# EAGLE design platform (EAGLE 6.4)
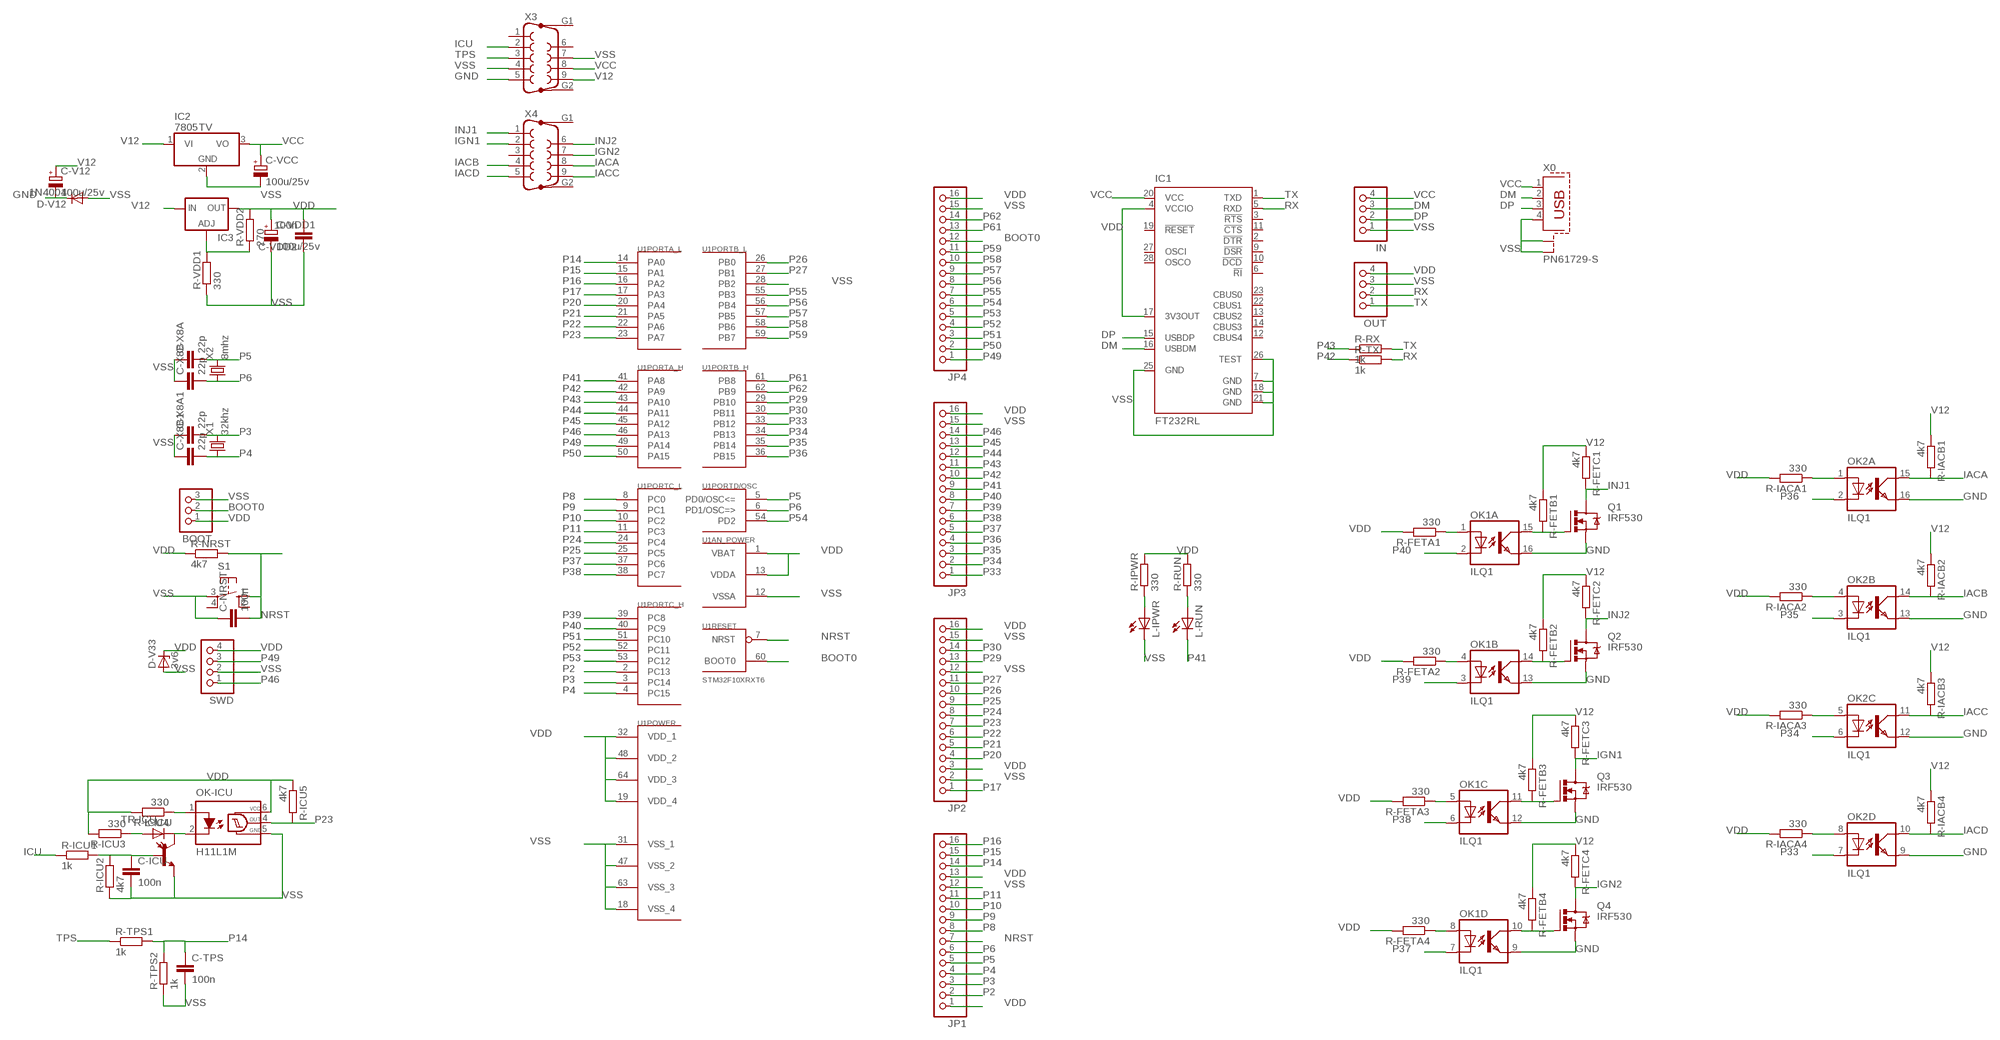
[diagram p0: schematic, sheet 1]

## Parts
BOOT  PINHD-1X3  [1X03]
C-ICU  100n  C-EU050-024X044  [C050-024X044]
C-NRST  100n  C-EU050-024X044  [C050-024X044]
C-TPS  100n  C-EU050-024X044  [C050-024X044]
C-V12  100u/25v  CPOL-EUE2-5  [E2-5]
C-VCC  100u/25v  CPOL-EUE2-5  [E2-5]
C-VDD1  100u/25v  CPOL-EUE2-5  [E2-5]
C-VDD2  100n  C-EU050-024X044  [C050-024X044]
C-X8A  22p  C-EU025-024X044  [C025-024X044]
C-X8A1  22p  C-EU025-024X044  [C025-024X044]
C-X8B  22p  C-EU025-024X044  [C025-024X044]
C-X8B1  22p  C-EU025-024X044  [C025-024X044]
D-V12  1N4004  [DO41-10]
D-V33  3v6  ZENER-DIODEZD-7.5  [ZDIO-7.5]
IC1  FT232RL  [SSOP28]
IC2  7805TV  [TO220V]
IC3  LM317TS  [317TS]
IN  PINHD-1X4  [1X04]
JP1  PINHD-1X16  [1X16]
JP2  PINHD-1X16  [1X16]
JP3  PINHD-1X16  [1X16]
JP4  PINHD-1X16  [1X16]
L-ICU  LED3MM  [LED3MM]
L-IPWR  LED3MM  [LED3MM]
L-RUN  LED3MM  [LED3MM]
OK1  ILQ1  [DIL16]
OK2  ILQ1  [DIL16]
OK-ICU  H11L1M  [DIL06]
OUT  PINHD-1X4  [1X04]
Q1  IRF530  [TO220BV]
Q2  IRF530  [TO220BV]
Q3  IRF530  [TO220BV]
Q4  IRF530  [TO220BV]
R-FETA1  330  R-EU_0204/7  [0204/7]
R-FETA2  330  R-EU_0204/7  [0204/7]
R-FETA3  330  R-EU_0204/7  [0204/7]
R-FETA4  330  R-EU_0204/7  [0204/7]
R-FETB1  4k7  R-EU_0204/7  [0204/7]
R-FETB2  4k7  R-EU_0204/7  [0204/7]
R-FETB3  4k7  R-EU_0204/7  [0204/7]
R-FETB4  4k7  R-EU_0204/7  [0204/7]
R-FETC1  4k7  R-EU_0204/7  [0204/7]
R-FETC2  4k7  R-EU_0204/7  [0204/7]
R-FETC3  4k7  R-EU_0204/7  [0204/7]
R-FETC4  4k7  R-EU_0204/7  [0204/7]
R-IACA1  330  R-EU_0204/7  [0204/7]
R-IACA2  330  R-EU_0204/7  [0204/7]
R-IACA3  330  R-EU_0204/7  [0204/7]
R-IACA4  330  R-EU_0204/7  [0204/7]
R-IACB1  4k7  R-EU_0204/7  [0204/7]
R-IACB2  4k7  R-EU_0204/7  [0204/7]
R-IACB3  4k7  R-EU_0204/7  [0204/7]
R-IACB4  4k7  R-EU_0204/7  [0204/7]
R-ICU1  1k  R-EU_0204/7  [0204/7]
R-ICU2  4k7  R-EU_0204/7  [0204/7]
R-ICU3  330  R-EU_0204/7  [0204/7]
R-ICU4  330  R-EU_0204/7  [0204/7]
R-ICU5  4k7  R-EU_0204/7  [0204/7]
R-IPWR  330  R-EU_0204/7  [0204/7]
R-NRST  4k7  R-EU_0204/7  [0204/7]
R-RUN  330  R-EU_0204/7  [0204/7]
R-RX  1k  R-EU_0204/7  [0204/7]
R-TPS1  1k  R-EU_0204/7  [0204/7]
R-TPS2  1k  R-EU_0204/7  [0204/7]
R-TX  1k  R-EU_0204/7  [0204/7]
R-VDD1  330  R-EU_0204/7  [0204/7]
R-VDD2  270  R-EU_0204/7  [0204/7]
S1  10-XX  [B3F-10XX]
SWD  PINHD-1X4  [1X04]
TR-ICU  2N3904-NPN-TO92-EBC  [TO92-EBC]
U1  STM32F10XRXT6  [TQFP64]
X0  PN61729-S  [PN61729-S]
X1  32khz  CRYSTALTC26V  [TC26V]
X2  8mhz  CRYSTALHC49U-V  [HC49U-V]
X3  F09HP  [F09HP]
X4  F09HP  [F09HP]

## Nets
BOOT0: BOOT.2 JP4.12 U1.60(RESET:BOOT0)
DM: IC1.16(USBDM) IN.3 X0.2
DP: IC1.15(USBDP) IN.2 X0.3
GND: C-V12.- D-V12.C OK1.9(D:EMIT) OK1.12(C:EMIT) OK1.13(B:EMIT) OK1.16(A:EMIT) OK2.9(D:EMIT) OK2.12(C:EMIT) OK2.13(B:EMIT) OK2.16(A:EMIT) Q1.S Q2.S Q3.S Q4.S X3.5
IACA: OK2.15(A:COL) R-IACB1.2 X4.8
IACB: OK2.14(B:COL) R-IACB2.2 X4.4
IACC: OK2.11(C:COL) R-IACB3.2 X4.9
IACD: OK2.10(D:COL) R-IACB4.2 X4.5
ICU: R-ICU1.1 X3.2
IGN1: Q3.D R-FETC3.2 X4.2
IGN2: Q4.D R-FETC4.2 X4.7
INJ1: Q1.D R-FETC1.2 X4.1
INJ2: Q2.D R-FETC2.2 X4.6
N$2: OK1.14(B:COL) Q2.G R-FETB2.2
N$3: C-ICU.1 R-ICU1.2 R-ICU2.2 TR-ICU.B
N$4: L-ICU.K(C) OK-ICU.2(C) TR-ICU.C
N$5: OK-ICU.1(A) R-ICU4.1
N$6: L-ICU.A R-ICU3.1
N$7: L-IPWR.A R-IPWR.1
N$8: L-RUN.A R-RUN.1
N$10: OK2.1(A:A) R-IACA1.1
N$11: OK1.15(A:COL) Q1.G R-FETB1.2
N$12: OK1.4(B:A) R-FETA2.1
N$13: OK1.1(A:A) R-FETA1.1
N$14: OK1.11(C:COL) Q3.G R-FETB3.2
N$15: OK1.5(C:A) R-FETA3.1
N$16: OK1.10(D:COL) Q4.G R-FETB4.2
N$17: OK1.8(D:A) R-FETA4.1
N$18: OK2.4(B:A) R-IACA2.1
N$21: OK2.5(C:A) R-IACA3.1
N$22: OK2.8(D:A) R-IACA4.1
N$25: IC3.1(ADJ) R-VDD1.2 R-VDD2.1
NRST: C-NRST.2 JP1.7 R-NRST.2 S1.1(S) U1.7(RESET:NRST)
P2: JP1.2 U1.2(PORTC_H:PC13)
P3: C-X8A1.2 JP1.3 U1.3(PORTC_H:PC14) X1.2
P4: C-X8B1.2 JP1.4 U1.4(PORTC_H:PC15) X1.1
P5: C-X8A.2 JP1.5 U1.5(PORTD/OSC:PD0/OSC<=) X2.2
P6: C-X8B.2 JP1.6 U1.6(PORTD/OSC:PD1/OSC=>) X2.1
P8: JP1.8 U1.8(PORTC_L:PC0)
P9: JP1.9 U1.9(PORTC_L:PC1)
P10: JP1.10 U1.10(PORTC_L:PC2)
P11: JP1.11 U1.11(PORTC_L:PC3)
P14: C-TPS.1 JP1.14 R-TPS1.2 R-TPS2.2 U1.14(PORTA_L:PA0)
P15: JP1.15 U1.15(PORTA_L:PA1)
P16: JP1.16 U1.16(PORTA_L:PA2)
P17: JP2.1 U1.17(PORTA_L:PA3)
P20: JP2.4 U1.20(PORTA_L:PA4)
P21: JP2.5 U1.21(PORTA_L:PA5)
P22: JP2.6 U1.22(PORTA_L:PA6)
P23: JP2.7 OK-ICU.4(OUT) R-ICU5.2 U1.23(PORTA_L:PA7)
P24: JP2.8 U1.24(PORTC_L:PC4)
P25: JP2.9 U1.25(PORTC_L:PC5)
P26: JP2.10 U1.26(PORTB_L:PB0)
P27: JP2.11 U1.27(PORTB_L:PB1)
P29: JP2.13 U1.29(PORTB_H:PB10)
P30: JP2.14 U1.30(PORTB_H:PB11)
P33: JP3.1 OK2.7(D:C) U1.33(PORTB_H:PB12)
P34: JP3.2 OK2.6(C:C) U1.34(PORTB_H:PB13)
P35: JP3.3 OK2.3(B:C) U1.35(PORTB_H:PB14)
P36: JP3.4 OK2.2(A:C) U1.36(PORTB_H:PB15)
P37: JP3.5 OK1.7(D:C) U1.37(PORTC_L:PC6)
P38: JP3.6 OK1.6(C:C) U1.38(PORTC_L:PC7)
P39: JP3.7 OK1.3(B:C) U1.39(PORTC_H:PC8)
P40: JP3.8 OK1.2(A:C) U1.40(PORTC_H:PC9)
P41: JP3.9 L-RUN.K(C) U1.41(PORTA_H:PA8)
P42: JP3.10 R-TX.1 U1.42(PORTA_H:PA9)
P43: JP3.11 R-RX.1 U1.43(PORTA_H:PA10)
P44: JP3.12 U1.44(PORTA_H:PA11)
P45: JP3.13 U1.45(PORTA_H:PA12)
P46: JP3.14 SWD.1 U1.46(PORTA_H:PA13)
P49: JP4.1 SWD.3 U1.49(PORTA_H:PA14)
P50: JP4.2 U1.50(PORTA_H:PA15)
P51: JP4.3 U1.51(PORTC_H:PC10)
P52: JP4.4 U1.52(PORTC_H:PC11)
P53: JP4.5 U1.53(PORTC_H:PC12)
P54: JP4.6 U1.54(PORTD/OSC:PD2)
P55: JP4.7 U1.55(PORTB_L:PB3)
P56: JP4.8 U1.56(PORTB_L:PB4)
P57: JP4.9 U1.57(PORTB_L:PB5)
P58: JP4.10 U1.58(PORTB_L:PB6)
P59: JP4.11 U1.59(PORTB_L:PB7)
P61: JP4.13 U1.61(PORTB_H:PB8)
P62: JP4.14 U1.62(PORTB_H:PB9)
RX: IC1.5(RXD) OUT.2 R-TX.2
TPS: R-TPS1.1 X3.3
TX: IC1.1(TXD) OUT.1 R-RX.2
V12: C-V12.+ IC2.1(VI) IC3.3(IN) R-FETB1.1 R-FETB2.1 R-FETB3.1 R-FETB4.1 R-FETC1.1 R-FETC2.1 R-FETC3.1 R-FETC4.1 R-IACB1.1 R-IACB2.1 R-IACB3.1 R-IACB4.1 X3.9
VCC: C-VCC.+ IC1.20(VCC) IC2.3(VO) IN.4 X0.1 X3.8
VDD: BOOT.1 C-VDD1.+ C-VDD2.2 D-V33.C IC1.4(VCCIO) IC1.17(3V3OUT) IC3.2(OUT) JP1.1 JP1.13 JP2.3 JP2.16 JP3.16 JP4.16 OK-ICU.6(VCC) OUT.4 R-FETA1.2 R-FETA2.2 R-FETA3.2 R-FETA4.2 R-IACA1.2 R-IACA2.2 R-IACA3.2 R-IACA4.2 R-ICU3.2 R-ICU4.2 R-ICU5.1 R-IPWR.2 R-NRST.1 R-RUN.2 R-VDD2.2 SWD.4 U1.1(AN_POWER:VBAT) U1.13(AN_POWER:VDDA) U1.19(POWER:VDD_4) U1.32(POWER:VDD_1) U1.48(POWER:VDD_2) U1.64(POWER:VDD_3)
VSS: BOOT.3 C-ICU.2 C-NRST.1 C-TPS.2 C-VCC.- C-VDD1.- C-VDD2.1 C-X8A1.1 C-X8A.1 C-X8B1.1 C-X8B.1 D-V12.A D-V33.A IC1.7(GND) IC1.18(GND) IC1.21(GND) IC1.25(GND) IC1.26(TEST) IC2.2(GND) IN.1 JP1.12 JP2.2 JP2.12 JP2.15 JP3.15 JP4.15 L-IPWR.K(C) OK-ICU.5(GND) OUT.3 R-ICU2.1 R-TPS2.1 R-VDD1.1 S1.3(P) SWD.2 TR-ICU.E U1.12(AN_POWER:VSSA) U1.18(POWER:VSS_4) U1.28(PORTB_L:PB2) U1.31(POWER:VSS_1) U1.47(POWER:VSS_2) U1.63(POWER:VSS_3) X0.4 X0.S1 X0.S2 X3.4 X3.7
Unconnected: IC1.2(!DTR) IC1.3(!RTS) IC1.6(!RI) IC1.9(!DSR) IC1.10(!DCD) IC1.11(!CTS) IC1.12(CBUS4) IC1.13(CBUS2) IC1.14(CBUS3) IC1.19(!RESET) IC1.22(CBUS1) IC1.23(CBUS0) IC1.27(OSCI) IC1.28(OSCO) S1.2(S1) S1.4(P1) X3.1 X3.6 X3.G1 X3.G2 X4.3 X4.G1 X4.G2

## Library data of the parts
BOOT = pinhead:PINHD-1X3: PIN HEADER
C-ICU C-NRST C-TPS C-VDD2 C-X8A C-X8A1 C-X8B C-X8B1 = resistor:C-EU: CAPACITOR, European symbol
C-V12 C-VCC C-VDD1 = resistor:CPOL-EU: POLARIZED CAPACITOR, European symbol
D-V12 = diode:1N4004: DIODE general purpose rectifier, 1 A
D-V33 = diode:ZENER-DIODE: Z-Diode
IC1 = ftdichip:FT232R: Source: http://www.ftdichip.com/Documents/DataSheets/DS_FT232R_v104.pdf; MPN: FT232RL; OC_FARNELL: 1146032; OC_NEWARK: 91K9918
IC2 = linear:78*: Positive VOLTAGE REGULATOR Source: http://cache.national.com/ds/LM/LM78L05.pdf http://www.fairchildsemi.com/ds/LM/LM7805.pdf
IC3 = v-reg:LM317TS: VOLTAGE REGULATOR
IN OUT SWD = pinhead:PINHD-1X4: PIN HEADER
JP1-JP4 = pinhead:PINHD-1X16: PIN HEADER
L-ICU L-IPWR L-RUN = led:LED: LED OSRAM: - CHIPLED LG R971, LG N971, LY N971, LG Q971, LY Q971, LO R971, LY R971 LH N974, LH R974 LS Q976, LO Q976, LY Q976 LO Q996 - Hyper CHIPLED LW Q18S LB Q993, LB Q99A, LB R99A - SideLED LS A670, LO A670, LY A670, LG A670, LP A670 LB A673, LV A673, LT A673, LW A673 LH A674 LY A675 LS A676, LA A676, LO A676, LY A676, LW A676 LS A679, LY A679, LG A679 - Hyper Micro SIDELED® LS Y876, LA Y876, LO Y876, LY Y876 LT Y87S - SmartLED LW L88C, LW L88S LB L89C, LB L89S, LG L890 LS L89K, LO L89K, LY L89K LS L896, LA L896, LO L896, LY L896 - TOPLED LS T670, LO T670, LY T670, LG T670, LP T670 LSG T670, LSP T670, LSY T670, LOP T670, LYG T670 LG T671, LOG T671, LSG T671 LB T673, LV T673, LT T673, LW T673 LH T674 LS T676, LA T676, LO T676, LY T676, LB T676, LH T676, LSB T676, LW T676 LB T67C, LV T67C, LT T67C, LS T67K, LO T67K, LY T67K, LW E67C LS E67B, LA E67B, LO E67B, LY E67B, LB E67C, LV E67C, LT E67C LW T67C LS T679, LY T679, LG T679 LS T770, LO T770, LY T770, LG T770, LP T770 LB T773, LV T773, LT T773, LW T773 LH T774 LS E675, LA E675, LY E675, LS T675 LS T776, LA T776, LO T776, LY T776, LB T776 LHGB T686 LT T68C, LB T68C - Hyper Mini TOPLED® LB M676 - Mini TOPLED Santana® LG M470 LS M47K, LO M47K, LY M47K Source: http://www.osram.convergy.de LUXEON: - LUMILED® LXK2-PW12-R00, LXK2-PW12-S00, LXK2-PW14-U00, LXK2-PW14-V00 LXK2-PM12-R00, LXK2-PM12-S00, LXK2-PM14-U00 LXK2-PE12-Q00, LXK2-PE12-R00, LXK2-PE12-S00, LXK2-PE14-T00, LXK2-PE14-U00 LXK2-PB12-K00, LXK2-PB12-L00, LXK2-PB12-M00, LXK2-PB14-N00, LXK2-PB14-P00, LXK2-PB14-Q00 LXK2-PR12-L00, LXK2-PR12-M00, LXK2-PR14-Q00, LXK2-PR14-R00 LXK2-PD12-Q00, LXK2-PD12-R00, LXK2-PD12-S00 LXK2-PH12-R00, LXK2-PH12-S00 LXK2-PL12-P00, LXK2-PL12-Q00, LXK2-PL12-R00 Source: www.luxeon.com KINGBRIGHT: KA-3528ASYC Source: www.kingbright.com
OK1 OK2 = optocoupler:ILQ1: SIEMENS OPTO COUPLER; MF: VISHAY/TELEFUNKEN; MPN: ILQ1; OC_FARNELL: 1469501; OC_NEWARK: 88K1954
OK-ICU = optocoupler:H11L*M: 6-Pin DIP Optocoupler Source: http://www.fairchildsemi.com/ds/H1/H11L2-M.pdf; MF: FAIRCHILD SEMICONDUCTOR; MPN: H11L1-M; OC_FARNELL: 1021127; OC_NEWARK: 72K8643
Q1-Q4 = transistor-power:IRF530: HEXFET Power MOSFET
R-FETA1-R-FETA4 R-FETB1-R-FETB4 R-FETC1-R-FETC4 R-IACA1-R-IACA4 R-IACB1-R-IACB4 R-ICU1-R-ICU5 R-IPWR R-NRST R-RUN R-RX R-TPS1 R-TPS2 R-TX R-VDD1 R-VDD2 = resistor:R-EU_: RESISTOR, European symbol
S1 = switch-omron:10-XX: OMRON SWITCH; MPN: B3F-1000; OC_FARNELL: 176432; OC_NEWARK: 36M3542
TR-ICU = transistor-neu-to92:*-NPN-: NPN Transistror
U1 = stm32:STM32F10XRXT6: STM32F101/103 64pin LQFP
X0 = con-berg:PN61729-S: BERG USB connector; OC_FARNELL: unknown; OC_NEWARK: unknown
X1 = crystal:CRYSTAL: CRYSTAL; OC_FARNELL: unknown; OC_NEWARK: unknown
X2 = crystal:CRYSTAL: CRYSTAL; OC_FARNELL: 1666969; OC_NEWARK: unknown
X3 X4 = con-subd:F09HP: SUB-D; OC_FARNELL: unknown; OC_NEWARK: unknown

## Board
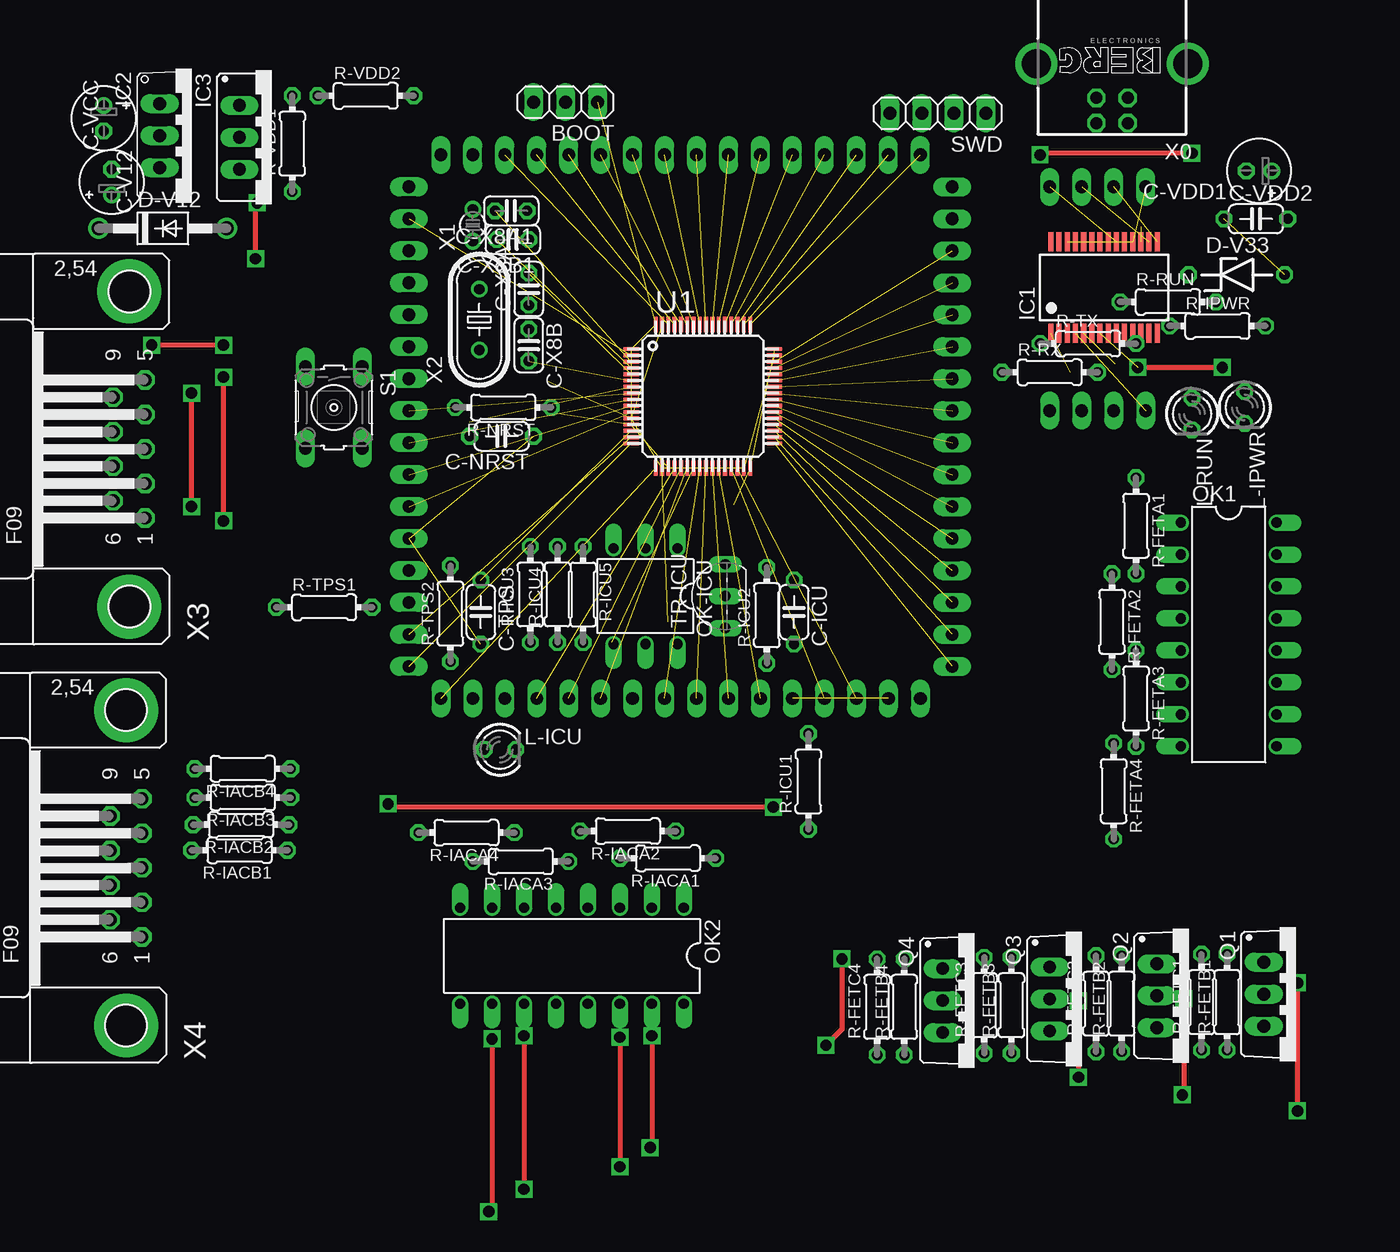
[diagram p1: board, top side]
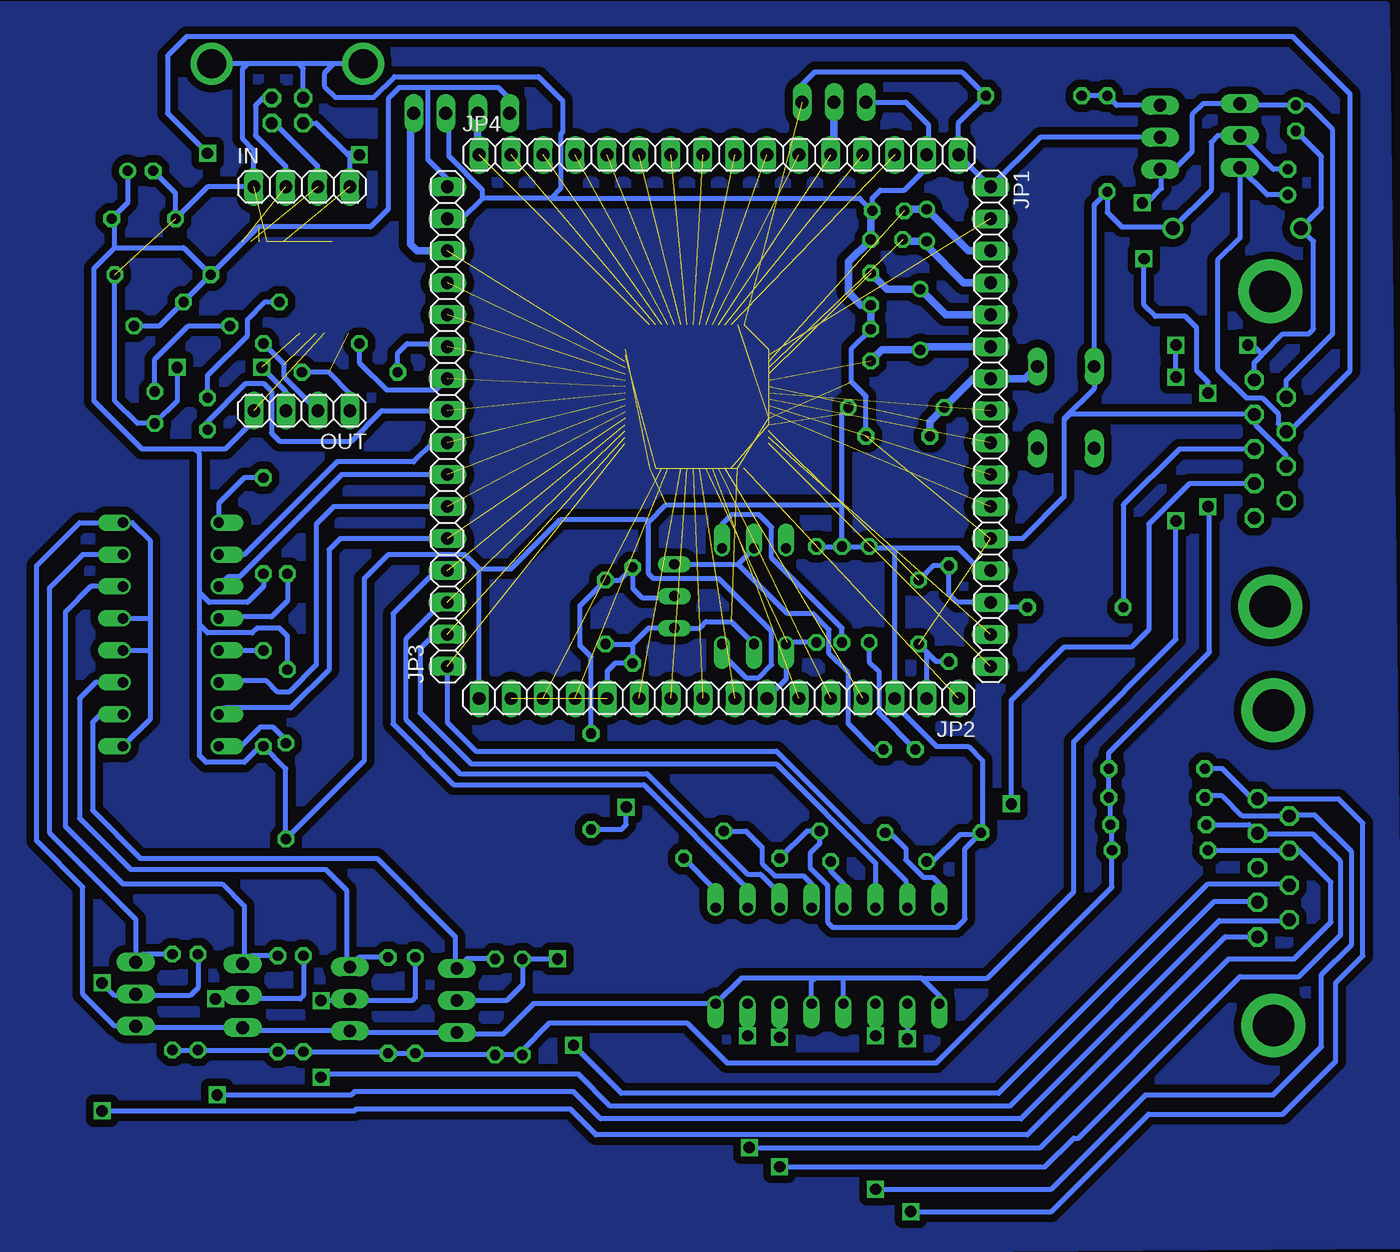
[diagram p2: board, bottom side, seen from below]

No outline drawn. Coordinates in mm, seen from the top.
Copper layers (1*16): Top 0.035mm / dielectric 1.5mm / Bottom 0.035mm
Design rules "default": minimum track width 10mil, minimum drill 24mil, track to track 8mil, track to pad 8mil, pad to pad 8mil, via to via 8mil, smd to smd 8mil, copper to edge 40mil, drill to drill 8mil, minimum pad ring 10mil, minimum via ring 8mil, stop-mask expansion 4mil, vias tented up to drill 0mil, thermal gap 10mil

### Footprints (pad centres in the part's own frame; a part is rotated, then mirrored left to right if it is on the bottom)
1X03 = drill 1.016 long: 1 -2.54,0; 2 0,0; 3 2.54,0
C050-024X044 = drill 0.813 octagon: 1 -2.54,0; 2 2.54,0
E2-5 = drill 0.813 pad 1.27: + -1.016,0 | drill 0.813 pad 1.27 octagon: - 1.016,0
C025-024X044 = drill 0.813 octagon: 1 -1.27,0; 2 1.27,0
DO41-10 = drill 1.118: A 5.08,0; C -5.08,0
ZDIO-7.5 = drill 0.813 octagon: A 3.81,0; C -3.81,0
SSOP28 = smd 0.4 x 1.5: 1 -4.225,-3.625; 2 -3.575,-3.625; 3 -2.925,-3.625; 4 -2.275,-3.625; 5 -1.625,-3.625; 6 -0.975,-3.625; 7 -0.325,-3.625; 8 0.325,-3.625; 9 0.975,-3.625; 10 1.625,-3.625; 11 2.275,-3.625; 12 2.925,-3.625; 13 3.575,-3.625; 14 4.225,-3.625; 15 4.225,3.625; 16 3.575,3.625; 17 2.925,3.625; 18 2.275,3.625; 19 1.625,3.625; 20 0.975,3.625; 21 0.325,3.625; 22 -0.325,3.625; 23 -0.975,3.625; 24 -1.625,3.625; 25 -2.275,3.625; 26 -2.925,3.625; 27 -3.575,3.625; 28 -4.225,3.625
TO220V = drill 1.016 long: 1 -2.54,-2.54; 2 0,-2.54; 3 2.54,-2.54
317TS = drill 1.016 long: 1 -2.54,-2.54; 2 0,-2.54; 3 2.54,-2.54
1X04 = drill 1.016 long: 1 -3.81,0; 2 -1.27,0; 3 1.27,0; 4 3.81,0
1X16 = drill 1.016 long: 1 -19.05,0; 2 -16.51,0; 3 -13.97,0; 4 -11.43,0; 5 -8.89,0; 6 -6.35,0; 7 -3.81,0; 8 -1.27,0; 9 1.27,0; 10 3.81,0; 11 6.35,0; 12 8.89,0; 13 11.43,0; 14 13.97,0; 15 16.51,0; 16 19.05,0
LED3MM = drill 0.813 octagon: A -1.27,0; K 1.27,0
DIL16 = drill 0.813 offset: 1 -8.89,-3.81; 2 -6.35,-3.81; 3 -3.81,-3.81; 4 -1.27,-3.81; 5 1.27,-3.81; 6 3.81,-3.81; 7 6.35,-3.81; 8 8.89,-3.81; 9 8.89,3.81; 10 6.35,3.81; 11 3.81,3.81; 12 1.27,3.81; 13 -1.27,3.81; 14 -3.81,3.81; 15 -6.35,3.81; 16 -8.89,3.81
DIL06 = drill 0.813 offset: 1 -2.54,-3.81; 2 0,-3.81; 3 2.54,-3.81; 4 2.54,3.81; 5 0,3.81; 6 -2.54,3.81
TO220BV = drill 1.016 long: D 0,-2.54; G -2.54,-2.54; S 2.54,-2.54
0204/7 = drill 0.813 octagon: 1 -3.81,0; 2 3.81,0
B3F-10XX = drill 1.016 long: 1 -3.251,2.261; 2 3.251,2.261; 3 -3.251,-2.261; 4 3.251,-2.261
TO92-EBC = drill 0.813 long: B 0,-1.27; C 2.54,-1.27; E -2.54,-1.27
TQFP64 = smd 1.2 x 0.3: 1 -5.7,3.75; 2 -5.7,3.25; 3 -5.7,2.75; 4 -5.7,2.25; 5 -5.7,1.75; 6 -5.7,1.25; 7 -5.7,0.75; 8 -5.7,0.25; 9 -5.7,-0.25; 10 -5.7,-0.75; 11 -5.7,-1.25; 12 -5.7,-1.75; 13 -5.7,-2.25; 14 -5.7,-2.75; 15 -5.7,-3.25; 16 -5.7,-3.75; 33 5.7,-3.75; 34 5.7,-3.25; 35 5.7,-2.75; 36 5.7,-2.25; 37 5.7,-1.75; 38 5.7,-1.25; 39 5.7,-0.75; 40 5.7,-0.25; 41 5.7,0.25; 42 5.7,0.75; 43 5.7,1.25; 44 5.7,1.75; 45 5.7,2.25; 46 5.7,2.75; 47 5.7,3.25; 48 5.7,3.75 | smd 0.3 x 1.2: 17 -3.75,-5.7; 18 -3.25,-5.7; 19 -2.75,-5.7; 20 -2.25,-5.7; 21 -1.75,-5.7; 22 -1.25,-5.7; 23 -0.75,-5.7; 24 -0.25,-5.7; 25 0.25,-5.7; 26 0.75,-5.7; 27 1.25,-5.7; 28 1.75,-5.7; 29 2.25,-5.7; 30 2.75,-5.7; 31 3.25,-5.7; 32 3.75,-5.7; 49 3.75,5.7; 50 3.25,5.7; 51 2.75,5.7; 52 2.25,5.7; 53 1.75,5.7; 54 1.25,5.7; 55 0.75,5.7; 56 0.25,5.7; 57 -0.25,5.7; 58 -0.75,5.7; 59 -1.25,5.7; 60 -1.75,5.7; 61 -2.25,5.7; 62 -2.75,5.7; 63 -3.25,5.7; 64 -3.75,5.7
PN61729-S = drill 0.95 octagon: 1 1.25,4.71; 2 -1.25,4.71; 3 -1.25,2.71; 4 1.25,2.71 | drill 2.3 pad 2.9: S1 -6.02,0; S2 6.02,0
TC26V = drill 0.813: 1 -1.27,0; 2 1.27,0
HC49U-V = drill 0.813: 1 -2.413,0; 2 2.413,0
F09HP = drill 1.016 octagon: 1 -5.486,-1.27; 2 -2.743,-1.27; 3 0,-1.27; 4 2.743,-1.27; 5 5.486,-1.27; 6 -4.115,1.27; 7 -1.372,1.27; 8 1.372,1.27; 9 4.115,1.27 | drill 3.302 pad 5.08: G1 -12.522,0; G2 12.522,0

### Placement (x,y rotation side)
BOOT  37.85,76.58 180 top
C-ICU  56.01,36.07 270 top
C-NRST  32.77,50.04 180 top
C-TPS  31.11,36.07 270 top
C-V12  1.14,75.31 270 top
C-VCC  1.78,70.23 90 top
C-VDD1  92.96,71.12 180 top
C-VDD2  92.71,67.31 0 top
C-X8A  34.92,61.72 90 top
C-X8A1  33.53,67.94 180 top
C-X8B  34.92,57.28 270 top
C-X8B1  33.66,65.66 180 top
D-V12  5.84,66.55 0 top
D-V33  91.19,62.87 0 top
IC1  80.64,61.85 0 top
IC2  8.13,73.91 270 top
IC3  14.48,73.79 270 top
IN  80.14,69.85 0 bottom
JP1  25.4,50.8 270 bottom
JP2  46.99,29.21 180 bottom
JP3  68.58,50.8 90 bottom
JP4  46.99,72.39 0 bottom
L-ICU  32.64,25.15 0 top
L-IPWR  91.82,52.32 270 top
L-RUN  87.63,51.82 270 top
OK1  90.55,34.29 270 top
OK2  38.35,8.76 180 top
OK-ICU  44.2,37.34 180 top
OUT  80.14,52.07 180 bottom
Q1  95.89,5.71 270 top
Q2  87.38,5.59 270 top
Q3  78.87,5.33 270 top
Q4  70.36,5.21 270 top
R-FETA1  83.19,42.93 270 top
R-FETA2  81.28,35.31 270 top
R-FETA3  83.19,29.21 270 top
R-FETA4  81.41,21.84 270 top
R-FETB1  90.42,5.08 90 top
R-FETB2  82.04,4.95 90 top
R-FETB3  73.28,4.83 90 top
R-FETB4  64.77,4.7 90 top
R-FETC1  88.39,5.08 90 top
R-FETC2  80.01,4.95 90 top
R-FETC3  71.12,4.83 90 top
R-FETC4  62.61,4.7 90 top
R-IACA1  45.97,16.51 180 top
R-IACA2  42.8,18.67 180 top
R-IACA3  34.29,16.26 180 top
R-IACA4  29.97,18.54 180 top
R-IACB1  11.94,17.14 180 top
R-IACB2  12.06,19.18 180 top
R-IACB3  12.19,21.34 180 top
R-IACB4  12.19,23.62 180 top
R-ICU1  57.15,22.61 90 top
R-ICU2  53.85,35.81 90 top
R-ICU3  35.05,37.47 90 top
R-ICU4  37.21,37.47 90 top
R-ICU5  39.24,37.47 270 top
R-IPWR  89.66,58.8 0 top
R-NRST  32.89,52.32 180 top
R-RUN  85.72,60.71 0 top
R-RX  76.33,55.12 0 top
R-TPS1  18.67,36.45 0 top
R-TPS2  28.7,35.94 90 top
R-TX  79.38,57.4 0 top
R-VDD1  16.13,73.28 90 top
R-VDD2  21.97,77.09 0 top
S1  19.43,52.32 270 top
SWD  67.44,75.69 180 top
TR-ICU  49.28,37.34 90 top
U1  48.77,53.21 0 top
X0  81.28,79.63 180 top
X1  30.48,66.8 90 top
X2  30.99,59.31 90 top
X3  3.17,49.02 90 top
X4  2.92,15.75 90 top

### Tracks (layer width: path | path; a pad name or v marks a point on that pad's centre or on a via)
BOOT0  (1 unrouted)
  Bottom 0.61: BOOT.2 37.85,72.64 JP4.12
DM  (1 unrouted)
  Bottom 0.406: X0.2 82.28,74.92 78.87,71.5 IN.3
DP  (1 unrouted)
  Bottom 0.406: X0.3 83.23,76.92 83.82,76.33 83.82,73.91 81.41,71.5 IN.2
GND  (via drill 0.9)
  Top 0.406: v10.67,43.31 v10.67,54.74 | v10.67,57.28 v4.95,57.28
  Bottom 0.406: 92.2,35.56 92.2,41.78 93.6,43.18 OK1.16 97.79,43.18 101.22,39.75 101.22,17.91 97.54,14.22 97.54,5.71 95,3.17 Q1.S 93.22,3.05 Q2.S 84.58,2.79 Q3.S 76.2,2.67 Q4.S 67.69,2.54 64.14,2.54 61.72,4.95 OK2.16 45.21,6.99 39.37,6.99 | 92.2,35.56 92.2,32.89 | 92.2,32.89 92.2,27.56 OK1.9 | OK1.12 92.33,33.02 92.2,32.89 | OK1.13 92.2,35.56 | C-V12.- -0.89,72.26 -0.89,68.2 D-V12.C -0.25,65.53 -0.25,58.55 0.13,58.17 2.16,58.17 3.81,56.52 | X3.5 4.45,55.88 3.81,56.52 | OK2.9 29.46,5.59 30.86,6.99 | 30.86,6.99 37.08,6.99 | 37.08,6.99 39.37,6.99 | OK2.13 39.62,6.73 39.37,6.99 | OK2.12 37.08,6.99 | 30.86,6.99 25.65,6.99 18.8,13.84 18.8,25.78 10.67,33.91 v10.67,43.31 | v10.67,54.74 v10.67,57.28 | v4.95,57.28 4.57,57.28 3.81,56.52
IACA  (via drill 0.9)
  Top 0.406: v44.7,2.41 44.7,-6.35 v44.58,-6.48
  Bottom 0.406: R-IACB1.2 8.1,17.12 X4.8 1.63,17.14 0.89,17.14 -1.65,14.61 -1.65,11.43 1.27,8.51 6.48,8.51 21.46,-6.48 v44.58,-6.48 | OK2.15 v44.7,2.41
IACB  (via drill 0.9)
  Top 0.406: v42.16,2.29 v42.16,-8
  Bottom 0.406: OK2.14 v42.16,2.29 | v42.16,-8 21.08,-8 18.8,-5.71 18.41,-5.71 5.59,7.11 0.89,7.11 -2.41,10.41 -2.41,16.26 -0.25,18.41 4.12,18.41 X4.4 4.88,19.18 R-IACB2.2
IACC  (via drill 0.9)
  Top 0.406: v34.54,2.41 v34.54,-9.78
  Bottom 0.406: OK2.11 v34.54,2.41 | v34.54,-9.78 20.57,-9.78 13.08,-2.29 2.92,-2.29 -0.89,1.52 -0.89,7.24 -3.3,9.65 -3.3,17.02 -0.38,19.94 1.57,19.94 X4.9 5.38,19.86 6.99,21.46 8.26,21.46 R-IACB3.2
IACD  (via drill 0.9)
  Top 0.406: v32,2.16 32,-11.3 v31.75,-11.56
  Bottom 0.406: R-IACB4.2 6.99,23.62 4.6,21.23 X4.5 4.17,21.21 -2.29,21.21 -4.19,19.3 -4.19,8.76 -2.03,6.6 -2.03,0.38 2.16,-3.81 12.83,-3.81 20.57,-11.56 v31.75,-11.56 | OK2.10 v32,2.16
ICU  (via drill 0.9)
  Top 0.406: v54.36,20.57 24,20.57 v23.75,20.83
  Bottom 0.406: X3.2 9.6,46.28 12.83,43.05 12.83,34.67 14.22,33.27 19.56,33.27 23.75,29.08 v23.75,20.83 | R-ICU1.1 54.74,18.8 54.36,19.18 v54.36,20.57
IGN1  (via drill 0.9)
  Top 0.406: v78.61,5.21 v78.61,-0.89
  Bottom 0.406: 76.2,5.21 71.37,5.21 71.12,5.46 R-FETC3.2 | 76.2,5.21 Q3.D | 76.2,5.21 v78.61,5.21 | X4.2 4.27,13.08 7.62,13.08 23.88,-3.17 55.63,-3.17 58.17,-0.64 78.36,-0.64 v78.61,-0.89
IGN2  (via drill 0.9)
  Top 0.406: v59.82,8.51 59.82,2.92 v58.55,1.65
  Bottom 0.406: Q4.D 63.88,5.21 62.61,6.48 R-FETC4.2 v59.82,8.51 | X4.7 1.75,14.48 8.13,14.48 24.77,-2.16 54.74,-2.16 v58.55,1.65
INJ1  (via drill 0.9)
  Top 0.406: v96.01,6.6 v96.01,-3.56
  Bottom 0.406: 93.22,5.59 89.03,5.59 88.39,6.22 R-FETC1.2 | 93.22,5.59 Q1.D | 93.22,5.59 95,5.59 v96.01,6.6 | v96.01,-3.56 75.95,-3.56 75.82,-3.43 58.8,-3.43 56.77,-5.46 22.48,-5.46 6.73,10.29 4.22,10.29 X4.1
INJ2  (via drill 0.9)
  Top 0.406: v87,5.33 87,-2.16 v86.87,-2.29
  Bottom 0.406: 84.58,5.33 80.26,5.33 80.01,5.59 R-FETC2.2 | 84.58,5.33 Q2.D | 84.58,5.33 v87,5.33 | v86.87,-2.29 76.2,-2.29 75.95,-2.03 58.55,-2.03 56.39,-4.19 22.99,-4.19 7.24,11.56 1.73,11.56 X4.6
N$1
  pour Bottom (isolate 0.61): -5.97,84.2 105.16,84.2 105.54,-14.99 -7.11,-14.1
N$2
  Bottom 0.406: OK1.14 96.9,38.1 98.93,36.07 98.93,19.05 94.36,14.48 86.49,14.48 84.71,12.7 84.71,8.26 Q2.G 84.2,8.76 R-FETB2.2
N$3
  Bottom 0.406: TR-ICU.B 50.67,37.21 53.09,37.21 53.85,37.97 R-ICU2.2 54.86,38.61 C-ICU.1 58.04,36.58 58.04,33.4 57.15,32.51 R-ICU1.2
N$4
  Bottom 0.406: TR-ICU.C 45.47,39.88 | 45.47,39.88 OK-ICU.2 | L-ICU.K 34.67,25.15 36.7,27.18 36.7,31.24 38.23,32.77 38.23,34.67 39.5,35.94 41.53,35.94 45.47,39.88
N$5
  Bottom 0.406: R-ICU4.1 37.21,34.8 42.8,40.39 42.8,42.8 43.81,43.81 45.97,43.81 46.74,43.05 OK-ICU.1
N$6
  Bottom 0.406: R-ICU3.1 35.05,32.13 34.29,31.37 34.29,28.07 L-ICU.A
N$7
  Bottom 0.406: L-IPWR.A 91.82,56.13 89.15,58.8 R-IPWR.1
N$8
  Bottom 0.406: L-RUN.A 87.63,54.86 84.45,58.04 84.45,59.31 83.06,60.71 R-RUN.1
N$10
  Bottom 0.406: OK2.1 47.24,13.97 R-IACA1.1
N$11
  Bottom 0.406: OK1.15 97.54,40.64 100.2,37.97 100.2,18.54 93.34,11.68 Q1.G 92.71,8.89 R-FETB1.2
N$12
  Bottom 0.406: R-FETA2.1 81.28,36.96 82.55,35.69 86.61,35.69 OK1.4
N$13
  Bottom 0.406: R-FETA1.1 84.71,46.74 86.74,44.7 OK1.1
N$14
  Bottom 0.406: OK1.11 96.52,30.48 97.79,29.21 97.79,19.68 93.73,15.62 78.23,15.62 76.58,13.97 76.58,8.13 Q3.G 75.56,8.64 R-FETB3.2
N$15
  Bottom 0.406: OK1.5 R-FETA3.1
N$16
  Bottom 0.406: OK1.10 96.14,27.94 96.77,27.3 96.77,20.32 92.96,16.51 74.17,16.51 67.94,10.29 67.94,7.87 Q4.G 67.06,8.51 R-FETB4.2
N$17
  Bottom 0.406: R-FETA4.1 81.41,25.91 82.42,26.92 83.44,26.92 84.96,25.4 OK1.8
N$18
  Bottom 0.406: R-IACA2.1 44.83,18.67 43.56,17.4 43.56,16.13 42.55,15.11 40.26,15.11 39.62,14.48 OK2.4
N$21
  Bottom 0.406: R-IACA3.1 38.1,15.49 37.08,14.48 OK2.5
N$22
  Bottom 0.406: R-IACA4.1 33.4,18.54 32.13,17.27 32.13,16.38 30.73,14.99 29.97,14.99 29.46,14.48 OK2.8
N$25
  Bottom 0.406: IC3.1 15.37,76.33 R-VDD1.2 R-VDD2.1
N$32  (via drill 0.9)
  other vias: 75.56,72.39
NRST  (1 unrouted)
  Bottom 0.61: C-NRST.2 30.23,51.18 R-NRST.2 26.8,54.61 JP1.7 22.66,54.61 S1.1
P2  (1 unrouted)
P3  (1 unrouted)
  Bottom 0.61: JP1.3 27.18,64.77 X1.2 32.13,68.07 C-X8A1.2
P4  (1 unrouted)
  Bottom 0.61: C-X8B1.2 32.26,65.53 X1.1 30.48,65.15 27.56,62.23 JP1.4
P5  (1 unrouted)
  Bottom 0.61: JP1.5 28.96,59.69 X2.2 33.66,61.72 C-X8A.2
P6  (1 unrouted)
  Bottom 0.61: JP1.6 30.73,57.15 X2.1 34.04,56.9 C-X8B.2
P8  (1 unrouted)
P9  (1 unrouted)
P10  (1 unrouted)
P11  (1 unrouted)
P14  (1 unrouted)
  Bottom 0.406: R-TPS1.2 25.02,36.45 JP1.14 28.07,36.83 28.7,37.47 R-TPS2.2 29.97,39.75 C-TPS.1
P15  (1 unrouted)
P16  (1 unrouted)
P17  (1 unrouted)
P20  (1 unrouted)
P21  (1 unrouted)
P22  (1 unrouted)
P23  (1 unrouted)
  Bottom 0.406: R-ICU5.2 41.53,33.66 OK-ICU.4 41.66,30.73 JP2.7
P24  (1 unrouted)
P25  (1 unrouted)
P26  (1 unrouted)
P27  (1 unrouted)
P29  (1 unrouted)
P30  (1 unrouted)
P33  (1 unrouted)
  Bottom 0.406: JP3.1 68.58,27.3 66.29,25.02 42.42,25.02 32.13,14.73 32.13,12.7 OK2.7
P34  (1 unrouted)
  Bottom 0.406: JP3.2 69.6,34.29 70.74,33.15 70.74,28.07 66.67,24 42.42,24 34.54,16.13 OK2.6
P35  (1 unrouted)
  Bottom 0.406: JP3.3 68.96,36.83 71.88,33.91 71.88,27.56 67.56,23.24 52.7,23.24 44.7,15.24 43.69,15.24 42.16,13.72 OK2.3
P36  (1 unrouted)
  Bottom 0.406: JP3.4 69.47,39.37 72.9,35.94 72.9,27.18 68.07,22.35 52.96,22.35 44.7,14.1 OK2.2
P37  (1 unrouted)
  Bottom 0.406: JP3.5 77.09,41.91 77.98,41.02 77.98,31.5 81.03,28.45 86.23,28.45 OK1.7
P38  (1 unrouted)
  Bottom 0.406: JP3.6 77.6,44.45 78.99,43.05 78.99,31.88 81.15,29.72 82.04,29.72 82.93,30.61 86.61,30.61 OK1.6
P39  (1 unrouted)
  Bottom 0.406: JP3.7 76.96,46.99 85.09,38.86 85.98,38.86 OK1.3
P40  (1 unrouted)
  Bottom 0.406: JP3.8 69.72,49.53 71.25,48.01 77.34,48.01 84.71,40.64 OK1.2
P41  (1 unrouted)
  Bottom 0.406: L-RUN.K 87.63,51.18 84.58,54.23 83.19,54.23 82.55,53.59 82.55,50.29 81.92,49.66 76.2,49.66 73.79,52.07 JP3.9
P42  (1 unrouted)
  Bottom 0.406: R-TX.1 75.56,55.88 73.41,53.72 69.47,53.72 JP3.10
P43  (1 unrouted)
  Bottom 0.406: R-RX.1 72.52,56.64 71.75,57.4 68.83,57.4 JP3.11
P44  (1 unrouted)
P45  (1 unrouted)
P46  (1 unrouted)
  Bottom 0.61: JP3.14 70.99,64.77 71.5,65.28 71.5,75.44 SWD.1
P49  (1 unrouted)
  Bottom 0.61: SWD.3 66.17,72.52 JP4.1
P50  (1 unrouted)
P51  (1 unrouted)
P52  (1 unrouted)
P53  (1 unrouted)
P54  (1 unrouted)
P55  (1 unrouted)
P56  (1 unrouted)
P57  (1 unrouted)
P58  (1 unrouted)
P59  (1 unrouted)
P61  (1 unrouted)
P62  (1 unrouted)
RX  (1 unrouted)
  Bottom 0.406: OUT.2 81.53,54.74 81.53,55.75 R-TX.2
TPS
  Bottom 0.406: X3.3 10.41,49.02 14.86,44.58 R-TPS1.1
TX  (1 unrouted)
  Bottom 0.406: OUT.1 76.33,53.47 77.98,55.12 R-RX.2
V12  (via drill 0.9)
  Top 0.406: v8.13,44.45 v8.13,53.47 | v13.21,64.14 13.21,68.45 v13.34,68.58
  Bottom 0.406: R-FETB1.1 R-FETC1.1 82.17,1.27 R-FETB2.1 R-FETC2.1 73.41,1.14 R-FETB3.1 R-FETC3.1 70.99,0.89 R-FETB4.1 R-FETC4.1 62.61,1.27 60.45,3.43 49.53,3.43 46.35,0.25 29.72,0.25 15.75,14.22 R-IACB1.1 15.75,19.05 R-IACB2.1 15.88,21.21 R-IACB3.1 R-IACB4.1 16,24.89 8,32.89 8,44.32 v8.13,44.45 | X3.9 1.91,54.48 -1.78,58.17 -1.78,74.42 0.13,76.33 C-V12.+ 5.46,76.33 IC2.1 8.51,76.45 9.4,75.56 9.4,72.64 10.79,71.25 IC3.3 11.81,71.12 11.81,69.72 12.95,68.58 v13.34,68.58 | v8.13,53.47 8.13,54.36 9.02,55.24 9.02,58.67 9.91,59.56 12.32,59.56 13.21,60.45 v13.21,64.14
VCC  (via drill 0.6, 0.9)  (1 unrouted)
  Top 0.406: v87.63,72.52 v75.44,72.52
  Bottom 0.406: X0.1 78.98,74.92 76.58,72.52 | 76.58,72.52 76.33,72.26 IN.4 | v87.63,72.52 90.81,75.69 90.81,80.26 89.28,81.79 1.4,81.79 -3.17,77.22 -3.17,55.24 1.68,50.39 X3.8 2.54,51.03 2.54,51.82 3.81,53.09 5.08,53.09 7.37,55.37 7.37,64.01 5.59,65.79 IC2.3 3.43,69.22 C-VCC.+ | v75.44,72.52 76.58,72.52
VDD  (9 unrouted)
  Bottom 0.406: R-ICU5.1 R-ICU4.2 | R-ICU4.2 R-ICU3.2 34.92,41.15 33.27,41.15 | JP1.13 26.16,39.37 27.94,41.15 33.27,41.15 | R-IPWR.2 91.44,58.8 R-RUN.2 D-V33.C | OUT.4 83.95,50.8 84.45,50.8 86.23,49.02 88.65,49.02 | 95,65.02 96.65,63.37 96.65,52.83 92.84,49.02 88.65,49.02 | 95,65.02 89.53,65.02 D-V33.C | SWD.4 63.63,76.83 64.52,77.72 70.1,77.72 | 70.1,77.72 72.39,77.72 73.28,76.83 73.28,68.07 74.68,66.67 83.57,66.67 D-V33.C | JP3.16 68.58,70.48 70.1,72.01 70.1,77.72 | 33.27,41.15 33.02,40.89 JP2.3 33.02,28.7 29.72,25.4 27.18,25.4 26.04,24.26 26.04,18.67 R-IACA4.2 | R-ICU4.2 37.21,44.58 | 37.21,44.58 37.21,51.82 R-NRST.1 | OK-ICU.6 46.74,32.77 44.83,30.86 43.81,30.86 42.8,31.88 42.8,34.54 46.99,38.73 52.2,38.73 52.58,39.12 52.58,43.18 | 52.58,43.18 51.18,44.58 37.21,44.58 | R-FETA1.2 83.19,38.1 84.45,36.83 87.5,36.83 88.27,37.59 | 88.27,37.59 88.27,48.64 88.65,49.02 | R-FETA2.2 81.28,34.16 81.92,34.8 83.69,34.8 84.07,34.42 87.63,34.42 88.14,34.92 | 88.14,34.92 88.27,35.05 88.27,37.59 | 88.14,34.92 88.27,34.8 88.27,24.64 87.76,24.13 84.71,24.13 83.44,25.4 R-FETA3.2 81.41,23.62 R-FETA4.2 75.18,24.26 75.18,38.73 73.28,40.64 67.18,40.64 66.04,39.5 | R-IACA3.2 29.97,16.26 27.81,18.41 26.29,18.41 R-IACA4.2 | R-IACA1.2 40.01,18.67 R-IACA2.2 38.99,17.65 39.75,16.89 39.75,15.75 38.35,14.35 38.35,11.43 37.97,11.05 28.07,11.05 27.43,11.68 27.43,17.27 R-IACA4.2 | IC3.2 21.46,73.79 JP1.1 JP4.16 27.94,74.93 R-VDD2.2 27.69,78.99 39.37,78.99 40.39,77.98 BOOT.1 | C-VDD1.+ 93.98,68.58 C-VDD2.2 95,67.06 95,65.02 | JP2.16 66.04,39.5 | 66.04,39.5 63.5,39.5 59.56,43.43 52.83,43.43 52.58,43.18
VSS  (via drill 0.6, 0.9)  (16 unrouted)
  Top 0.406: v83.31,55.5 v90.04,55.5
  Bottom 0.406: 53.85,33.53 52.58,34.8 TR-ICU.E 48.51,34.8 48.01,35.31 45.97,35.31 OK-ICU.5 | 53.85,33.53 R-ICU2.1 55.24,32 55.88,31.37 JP2.12 | C-ICU.2 53.85,33.53 | 19.56,51.31 19.56,51.44 17.17,53.82 S1.3 17.17,68.43 R-VDD1.1 16.13,67.82 14.99,66.67 11.05,66.67 D-V12.A 7.87,69.6 7.87,73.41 7.37,73.91 IC2.2 2.92,71.25 C-VCC.- | 19.56,51.31 19.56,45.21 22.86,41.91 JP1.12 | R-TPS2.1 29.72,32.13 C-TPS.2 30.48,32.89 JP2.2 | 80.39,79.63 X0.S2 77.6,79.63 78.36,78.87 78.36,77.85 77.47,76.96 74.42,76.96 72.77,78.61 61.34,78.61 59.44,76.71 59.44,74.17 59.56,74.04 59.56,69.72 60.33,68.96 | 80.39,79.63 84.45,79.63 | 84.45,79.63 X0.S1 | X0.4 80.03,79.27 80.39,79.63 | 84.45,79.63 84.84,79.25 84.84,73.66 83.95,72.77 IN.1 87.63,69.85 C-VDD2.1 90.17,69.34 C-VDD1.- | D-V33.A 95,52.83 93.22,51.05 L-IPWR.K 90.04,52.83 v90.04,55.5 | JP3.15 67.44,67.31 65.79,68.96 | 65.79,68.96 65.79,69.6 68.45,72.26 68.45,75.44 SWD.2 | OUT.3 81.41,53.59 v83.31,55.5 | C-NRST.1 35.31,53.21 36.45,54.36 36.45,57.02 C-X8B.1 | BOOT.3 32.13,76.58 30.35,74.8 30.35,72.52 JP4.15 30.48,71.37 32.26,69.6 34.16,69.6 34.8,68.96 C-X8A1.1 35.81,68.96 60.33,68.96 | 60.33,68.96 65.79,68.96 | 19.56,51.31 19.1,51.77 X3.4 4.32,51.64 4.32,50.93 1.91,48.51 X3.7
  Bottom 0.61: C-X8B.1 C-X8A.1 35.69,60.45 36.7,61.47 36.7,63.88 C-X8B1.1 34.92,67.82 C-X8A1.1